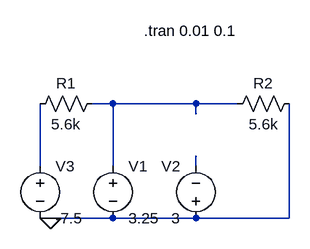
[diagram p0: schematic Draft34.asc]
Draft34.asc, the LTspice schematic file:
Version 4
SHEET 1 880 680
WIRE 176 208 144 208
WIRE 304 208 176 208
WIRE 368 208 304 208
WIRE 304 224 304 208
WIRE 64 304 64 208
WIRE 176 304 176 208
WIRE 304 304 304 288
WIRE 80 384 64 384
WIRE 176 384 80 384
WIRE 304 384 176 384
WIRE 448 384 448 208
WIRE 448 384 304 384
FLAG 80 384 0
SYMBOL voltage 176 288 R0
SYMATTR InstName V1
SYMATTR Value 3.25
SYMBOL voltage 64 288 R0
SYMATTR InstName V3
SYMATTR Value -7.5
SYMBOL res 160 192 R90
WINDOW 0 0 56 VBottom 2
WINDOW 3 32 56 VTop 2
SYMATTR InstName R1
SYMATTR Value 5.6k
SYMBOL res 464 192 R90
WINDOW 0 0 56 VBottom 2
WINDOW 3 32 56 VTop 2
SYMATTR InstName R2
SYMATTR Value 5.6k
SYMBOL voltage 304 400 R180
WINDOW 0 24 96 Left 2
WINDOW 3 24 16 Left 2
SYMATTR InstName V2
SYMATTR Value 3
TEXT 224 96 Left 2 !.tran 0.01 0.1

The netlist it stands for:
* Draft34.asc
V1 N001 0 3.25
V3 N002 0 -7.5
R1 N001 N002 5.6k
R2 0 N001 5.6k
V2 0 N003 3
.tran 0.01 0.1
.backanno
.end